# Altium schematic sheet Sheet1.SchDoc
size A1
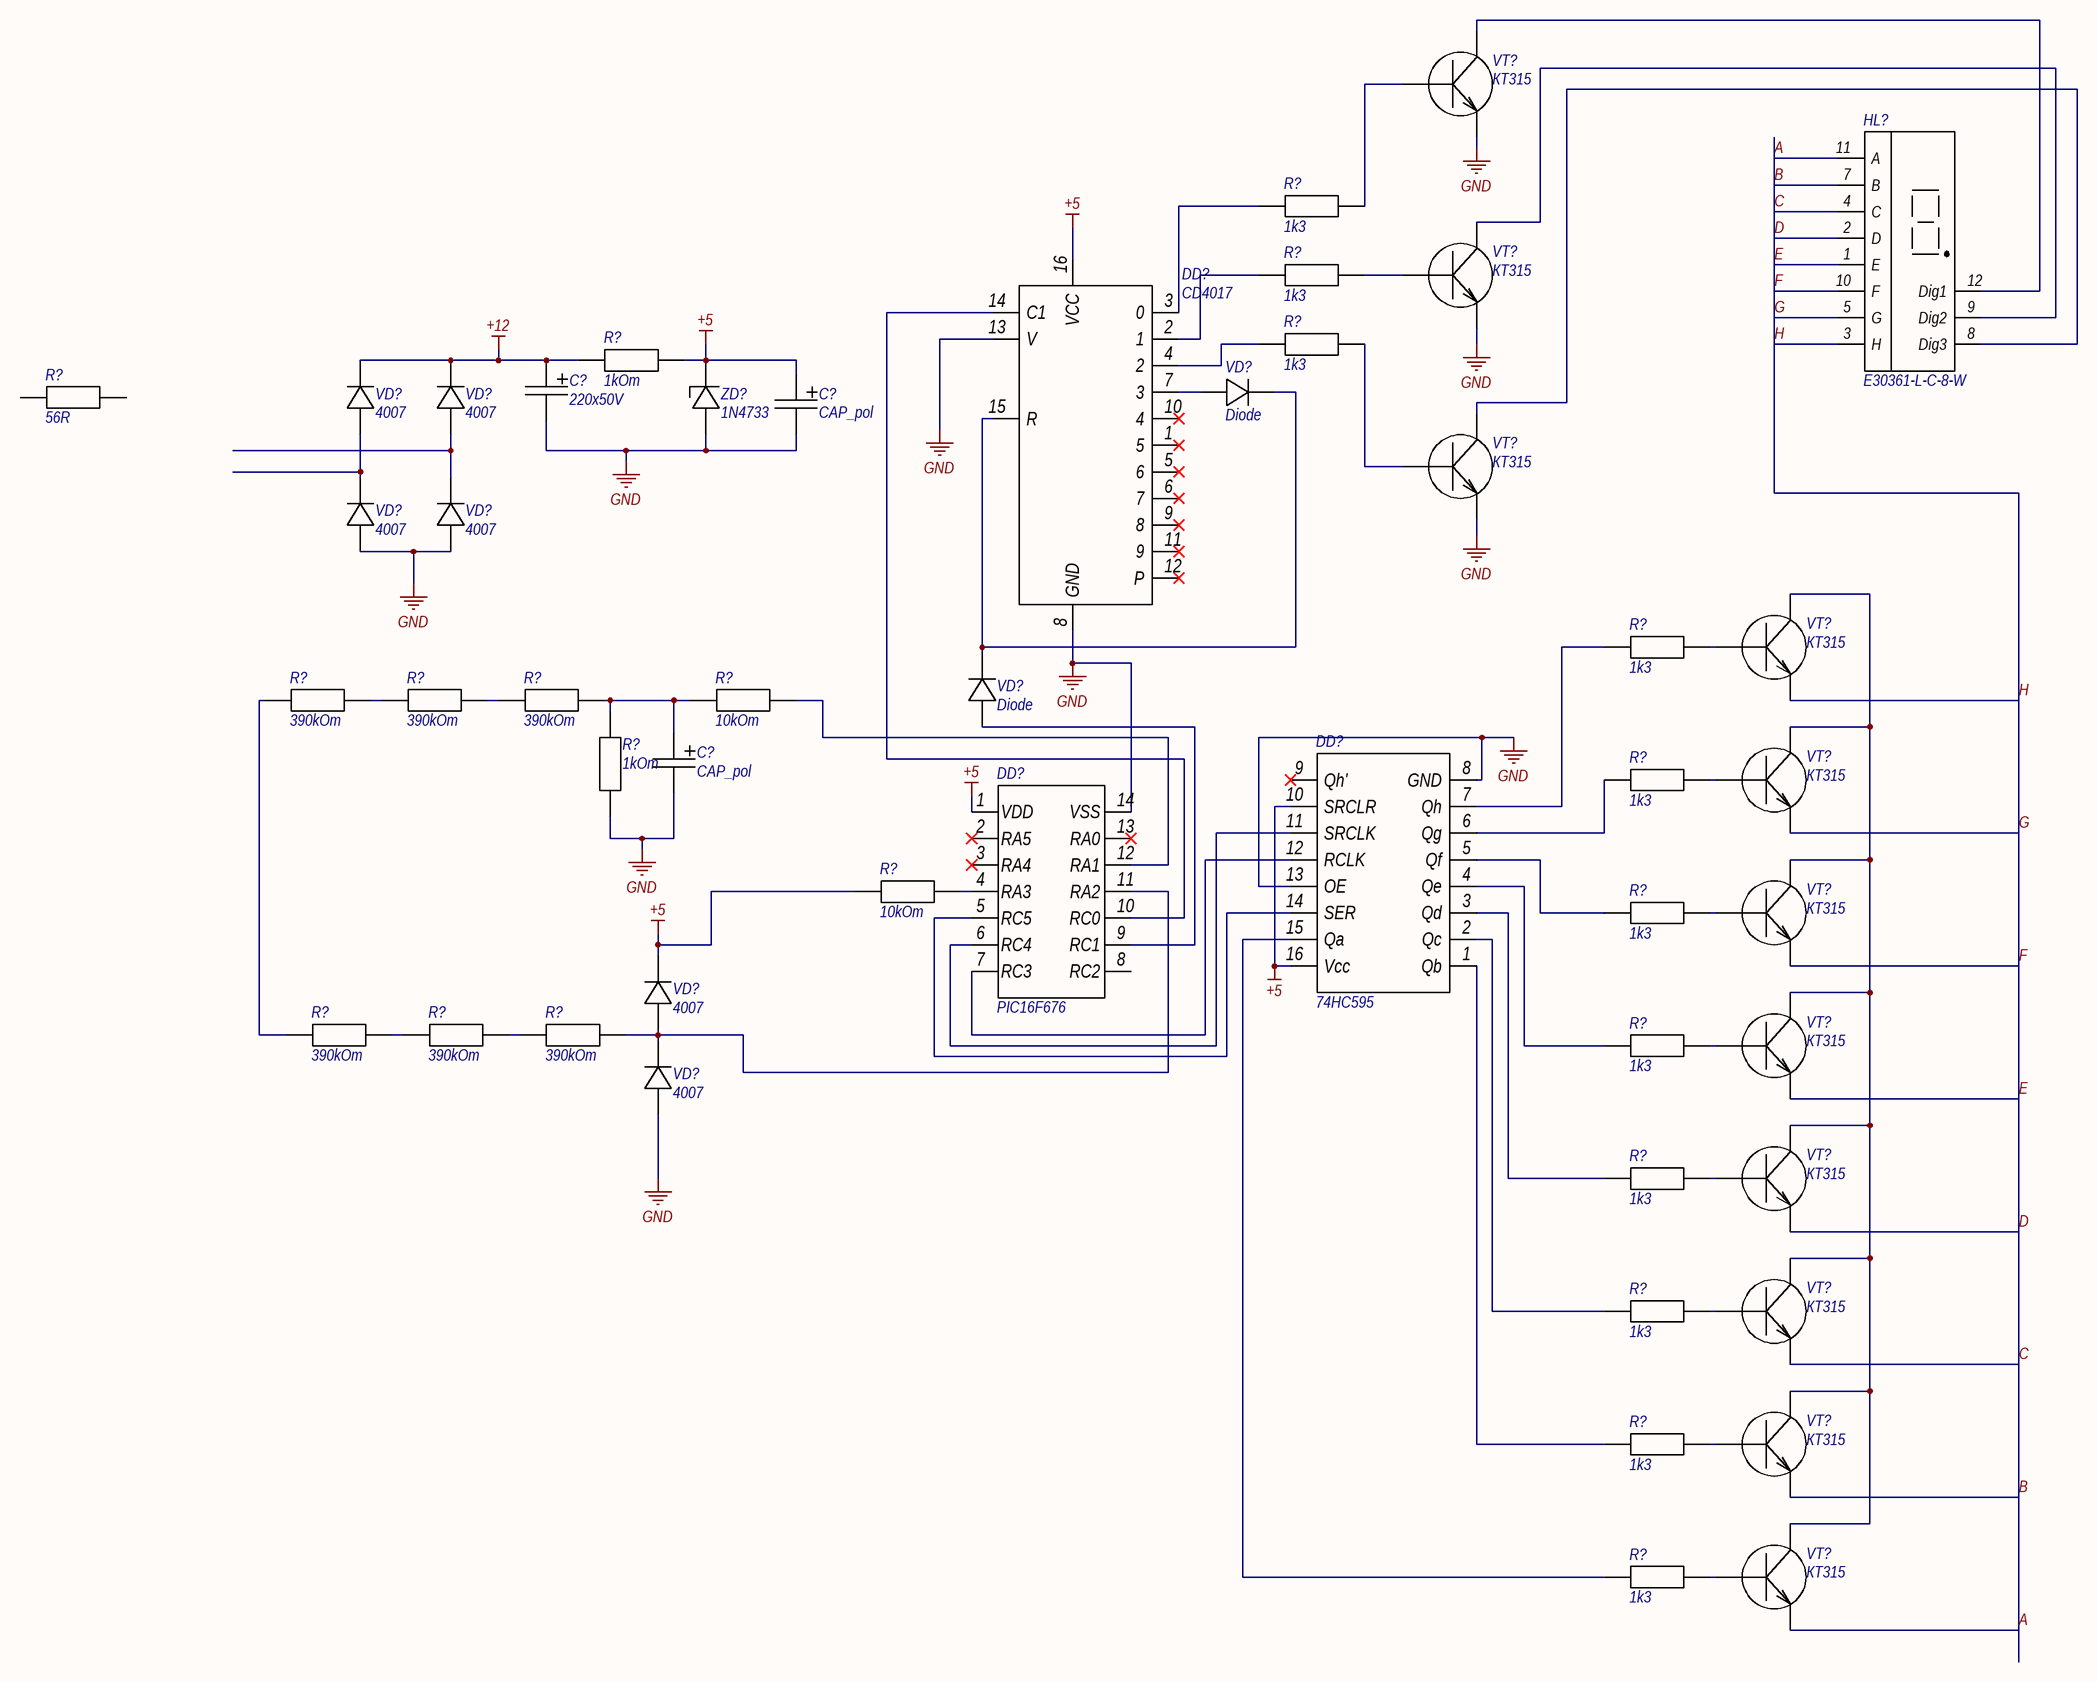
[diagram p0: Sheet1.SchDoc]

## Parts
(Parts that share a designator on the sheet are numbered #1, #2 ... from top to bottom, then left to right.)
C?#1  220x50V  [CAP_10x12_5]
C?#2  CAP_pol  [CAP_POL_5mm]
C?#3  CAP_pol  [CAP_POL_5mm]
DD?#1  CD4017  [DIP16]
DD?#2  PIC16F676  [DIP14]
DD?#3  74HC595  [DIP16]
HL?  E30361-L-C-8-W  [E30361-L-C-8-W]
R?#1  1k3  [RES_0.25W_gorizontal]
R?#2  1k3  [RES_0.25W_gorizontal]
R?#3  1k3  [RES_0.25W_gorizontal]
R?#4  1kOm  [KNP-200]
R?#5  56R  [KNP-200]
R?#6  1k3  [RES_0.25W_gorizontal]
R?#7  390kOm  [Res0.25W]
R?#8  390kOm  [Res0.25W]
R?#9  390kOm  [Res0.25W]
R?#10  10kOm  [Res0.25W]
R?#11  1k3  [RES_0.25W_gorizontal]
R?#12  1kOm  [Res0.25W]
R?#13  10kOm  [Res0.25W]
R?#14  1k3  [RES_0.25W_gorizontal]
R?#15  390kOm  [Res0.25W]
R?#16  390kOm  [Res0.25W]
R?#17  390kOm  [Res0.25W]
R?#18  1k3  [RES_0.25W_gorizontal]
R?#19  1k3  [RES_0.25W_gorizontal]
R?#20  1k3  [RES_0.25W_gorizontal]
R?#21  1k3  [RES_0.25W_gorizontal]
R?#22  1k3  [RES_0.25W_gorizontal]
VD?#1  Diode  [Д226]
VD?#2  4007  [DO-41]
VD?#3  4007  [DO-41]
VD?#4  4007  [DO-41]
VD?#5  4007  [DO-41]
VD?#6  Diode  [Д226]
VD?#7  4007  [DO-41]
VD?#8  4007  [DO-41]
VT?#1  КТ315  [Transistors]
VT?#2  КТ315  [Transistors]
VT?#3  КТ315  [Transistors]
VT?#4  КТ315  [Transistors]
VT?#5  КТ315  [Transistors]
VT?#6  КТ315  [Transistors]
VT?#7  КТ315  [Transistors]
VT?#8  КТ315  [Transistors]
VT?#9  КТ315  [Transistors]
VT?#10  КТ315  [Transistors]
VT?#11  КТ315  [Transistors]
ZD?  1N4733  [DO-41]

## Nets
+5: C?#2.1 DD?#1.16(VCC) DD?#2.1(VDD) DD?#3.10(SRCLR) DD?#3.16(Vcc) R?#4.2 R?#13.1 VD?#7.Cathode ZD?.Cathode
+12: C?#1.1 R?#4.1 VD?#2.Cathode VD?#3.Cathode
GND: C?#1.2 C?#2.2 C?#3.2 DD?#1.8(GND) DD?#1.13(V) DD?#2.14(VSS) DD?#3.8(GND) DD?#3.13(OE) R?#12.1 VD?#4.1(Anode) VD?#5.1(Anode) VD?#8.1(Anode) VT?#1.2 VT?#2.2 VT?#3.2 ZD?.Anode
A: HL?.11(A) VT?#11.2
B: HL?.7(B) VT?#10.2
C: HL?.4(C) VT?#9.2
D: HL?.2(D) VT?#8.2
E: HL?.1(E) VT?#7.2
F: HL?.10(F) VT?#6.2
G: HL?.5(G) VT?#5.2
H: HL?.3(H) VT?#4.2
NetC?#3_1: C?#3.1 R?#9.2 R?#10.1 R?#12.2
NetDD?#1_2: DD?#1.2(1) R?#2.1
NetDD?#1_3: DD?#1.3(0) R?#1.1
NetDD?#1_4: DD?#1.4(2) R?#3.1
NetDD?#1_7: DD?#1.7(3) VD?#1.1(Anode)
NetDD?#1_14: DD?#1.14(C1) DD?#2.10(RC0)
NetDD?#1_15: DD?#1.15(R) VD?#1.Cathode VD?#6.Cathode
NetDD?#2_4: DD?#2.4(RA3) R?#13.2
NetDD?#2_5: DD?#2.5(RC5) DD?#3.14(SER)
NetDD?#2_6: DD?#2.6(RC4) DD?#3.11(SRCLK)
NetDD?#2_7: DD?#2.7(RC3) DD?#3.12(RCLK)
NetDD?#2_9: DD?#2.9(RC1) VD?#6.1(Anode)
NetDD?#2_11: DD?#2.11(RA2) R?#17.2 VD?#7.1(Anode) VD?#8.Cathode
NetDD?#2_12: DD?#2.12(RA1) R?#10.2
NetDD?#3_1: DD?#3.1(Qb) R?#21.1
NetDD?#3_2: DD?#3.2(Qc) R?#20.1
NetDD?#3_3: DD?#3.3(Qd) R?#19.1
NetDD?#3_4: DD?#3.4(Qe) R?#18.1
NetDD?#3_5: DD?#3.5(Qf) R?#14.1
NetDD?#3_6: DD?#3.6(Qg) R?#11.1
NetDD?#3_7: DD?#3.7(Qh) R?#6.1
NetDD?#3_15: DD?#3.15(Qa) R?#22.1
NetHL?_8: HL?.8(Dig3) VT?#3.3
NetHL?_9: HL?.9(Dig2) VT?#2.3
NetHL?_12: HL?.12(Dig1) VT?#1.3
NetR?#1_2: R?#1.2 VT?#1.1
NetR?#2_2: R?#2.2 VT?#2.1
NetR?#3_2: R?#3.2 VT?#3.1
NetR?#6_2: R?#6.2 VT?#4.1
NetR?#7_1: R?#7.1 R?#15.1
NetR?#7_2: R?#7.2 R?#8.1
NetR?#8_2: R?#8.2 R?#9.1
NetR?#11_2: R?#11.2 VT?#5.1
NetR?#14_2: R?#14.2 VT?#6.1
NetR?#15_2: R?#15.2 R?#16.1
NetR?#16_2: R?#16.2 R?#17.1
NetR?#18_2: R?#18.2 VT?#7.1
NetR?#19_2: R?#19.2 VT?#8.1
NetR?#20_2: R?#20.2 VT?#9.1
NetR?#21_2: R?#21.2 VT?#10.1
NetR?#22_2: R?#22.2 VT?#11.1
NetVD?#2_1: VD?#2.1(Anode) VD?#4.Cathode
NetVD?#3_1: VD?#3.1(Anode) VD?#5.Cathode
NetVT?#4_3: VT?#4.3 VT?#5.3 VT?#6.3 VT?#7.3 VT?#8.3 VT?#9.3 VT?#10.3 VT?#11.3

Not connected (* = marked no-connect by the designer): DD?#1 1(5)* 5(6)* 6(7)* 9(8)* 10(4)* 11(9)* 12(P)*; DD?#2 2(RA5)* 3(RA4)* 8(RC2) 13(RA0)*; DD?#3 9(Qh')*; R?#5 1 2

## Library data of the parts
C?#1 = CAP_pol
R?#1-R?#6 R?#11 R?#14 R?#18-R?#22 = Resistor
R?#7-R?#10 R?#12 R?#13 R?#15-R?#17 = RES
VD?#2-VD?#5 VD?#7 VD?#8 = Diode
VT?#1-VT?#11 = TRANSISTORS_N-P-N
ZD? = Zener